# EAGLE design grab (EAGLE 6.6.0)

## Sheet 1 of 2
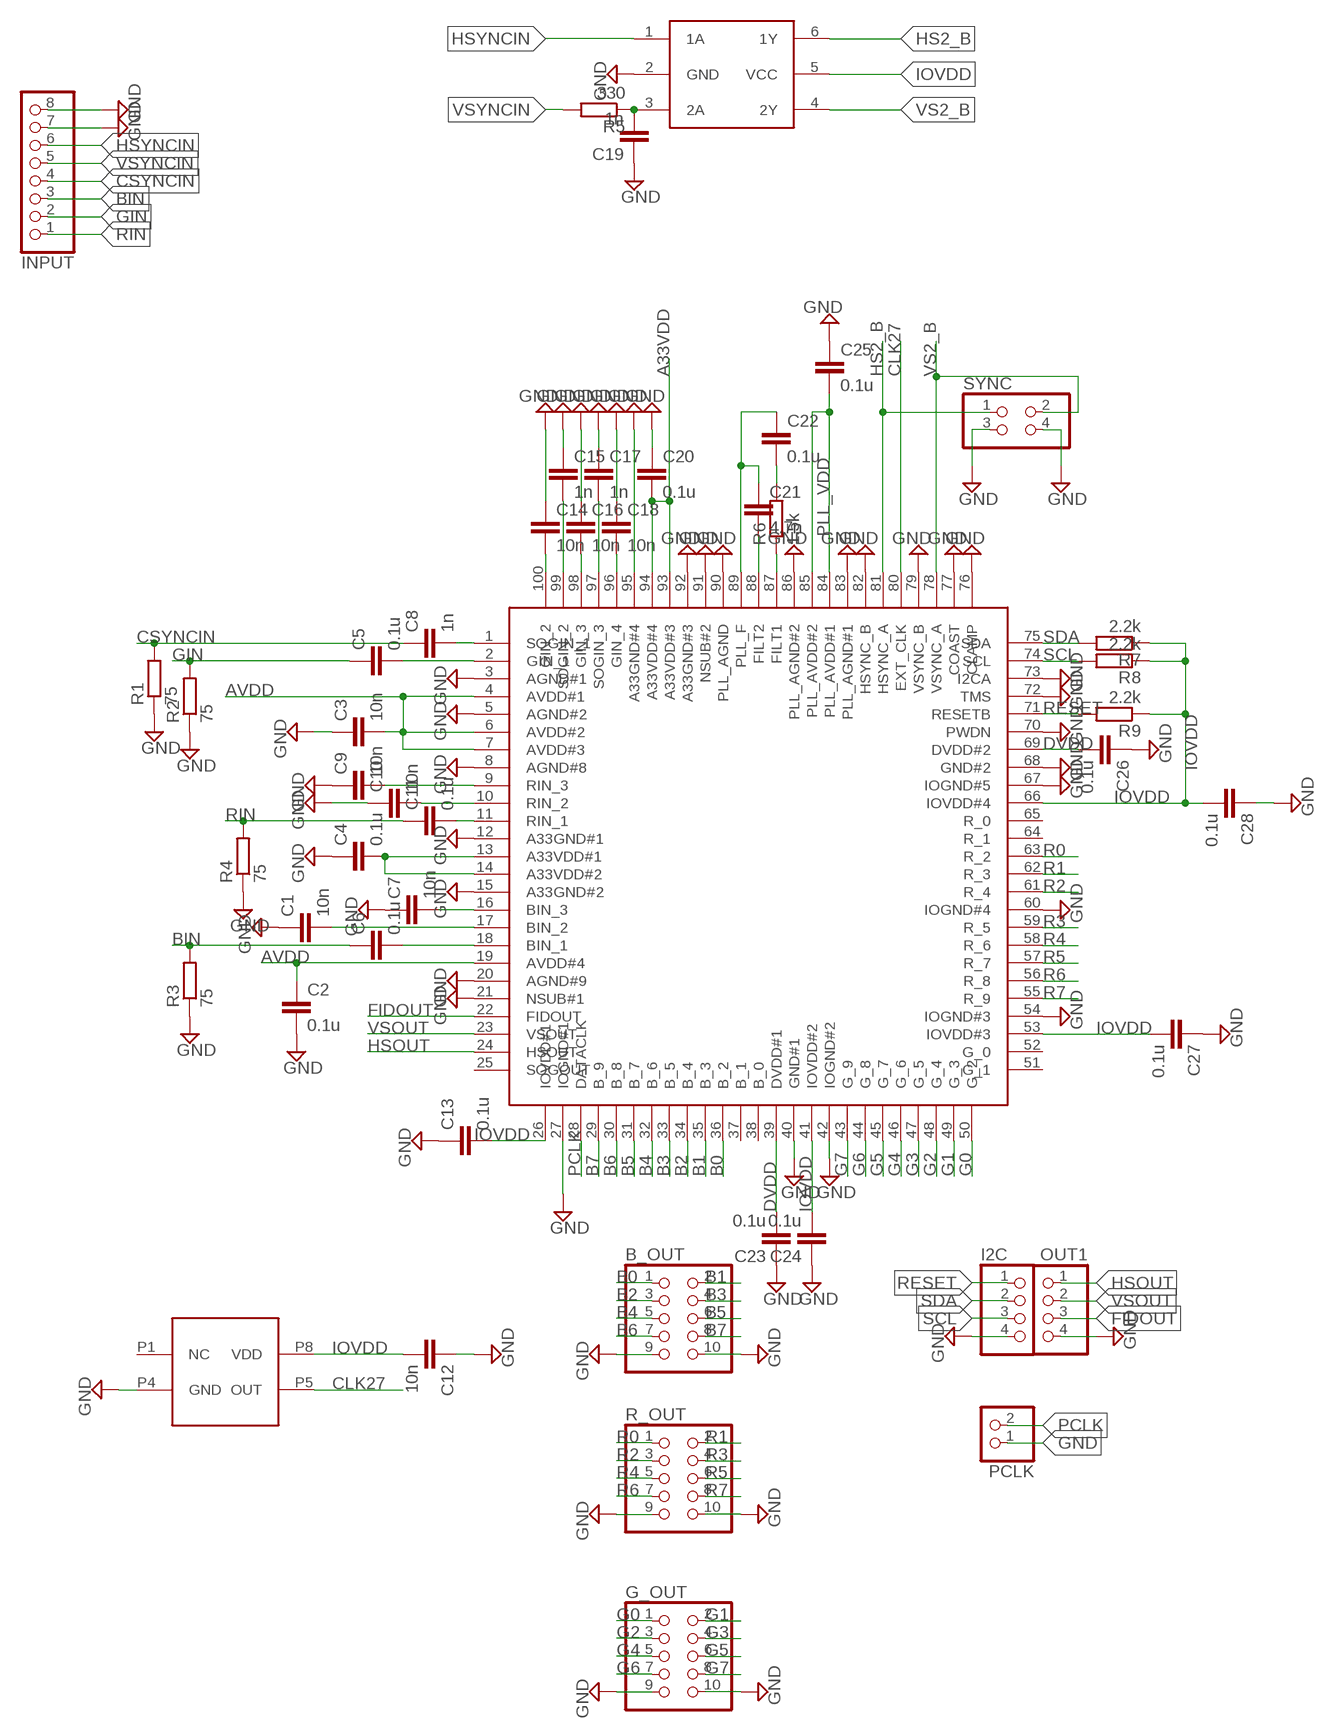
[diagram p0: schematic, sheet 1]

### Parts
27MHZ  ACHL-27MHZ-EK  [DIP4]
B_OUT  PINHD-2X5  [2X05]
C1  10n  C-EUC0603  [C0603]
C2  0.1u  C-EUC0603  [C0603]
C3  10n  C-EUC0603  [C0603]
C4  0.1u  C-EUC0603  [C0603]
C5  0.1u  C-EUC0603  [C0603]
C6  0.1u  C-EUC0603  [C0603]
C7  10n  C-EUC0603  [C0603]
C8  1n  C-EUC0603  [C0603]
C9  10n  C-EUC0603  [C0603]
C10  10n  C-EUC0603  [C0603]
C11  0.1u  C-EUC0603  [C0603]
C12  10n  C-EUC0805  [C0805]
C13  0.1u  C-EUC0603  [C0603]
C14  10n  C-EUC0603  [C0603]
C15  1n  C-EUC0603  [C0603]
C16  10n  C-EUC0603  [C0603]
C17  1n  C-EUC0603  [C0603]
C18  10n  C-EUC0603  [C0603]
C19  1n  C-EUC0805  [C0805]
C20  0.1u  C-EUC0603  [C0603]
C21  4.7n  C-EUC0603  [C0603]
C22  0.1u  C-EUC0603  [C0603]
C23  0.1u  C-EUC0603  [C0603]
C24  0.1u  C-EUC0603  [C0603]
C25  0.1u  C-EUC0603  [C0603]
C26  0.1u  C-EUC0603  [C0603]
C27  0.1u  C-EUC0603  [C0603]
C28  0.1u  C-EUC0603  [C0603]
G_OUT  PINHD-2X5  [2X05]
I2C  PINHD-1X4  [1X04]
INPUT  PINHD-1X8  [1X08]
OUT1  PINHD-1X4  [1X04]
PCLK  PINHD-1X2  [1X02]
R1  75  R-EU_R0603  [R0603]
R2  75  R-EU_R0603  [R0603]
R3  75  R-EU_R0603  [R0603]
R4  75  R-EU_R0603  [R0603]
R5  330  R-EU_R0805  [R0805]
R6  1.5k  R-EU_R0603  [R0603]
R7  2.2k  R-EU_R0603  [R0603]
R8  2.2k  R-EU_R0603  [R0603]
R9  2.2k  R-EU_R0603  [R0603]
R_OUT  PINHD-2X5  [2X05]
SYNC  PINHD-2X2  [2X02]
SYNC_IC  SN74LVC2G17SC-70-6  [SC70-6L]
TVP7002  TVP7002  [TQFP100]

### Nets
A33VDD: C4.2 C20.2 TVP7002.13(A33VDD#1) TVP7002.14(A33VDD#2) TVP7002.93(A33VDD#3) TVP7002.94(A33VDD#4) ; also sheet 2
AVDD: C2.1 C3.2 TVP7002.4(AVDD#1) TVP7002.6(AVDD#2) TVP7002.7(AVDD#3) TVP7002.19(AVDD#4) ; also sheet 2
B0: B_OUT.1 TVP7002.36(B_2)
B1: B_OUT.2 TVP7002.35(B_3)
B2: B_OUT.3 TVP7002.34(B_4)
B3: B_OUT.4 TVP7002.33(B_5)
B4: B_OUT.5 TVP7002.32(B_6)
B5: B_OUT.6 TVP7002.31(B_7)
B6: B_OUT.7 TVP7002.30(B_8)
B7: B_OUT.8 TVP7002.29(B_9)
BIN: C6.1 INPUT.3 R3.2
CLK27: 27MHZ.P5(OUT) TVP7002.80(EXT_CLK)
CSYNCIN: C8.1 INPUT.4 R1.2
DVDD: C23.2 C26.2 TVP7002.39(DVDD#1) TVP7002.69(DVDD#2) ; also sheet 2
FIDOUT: OUT1.3 TVP7002.22(FIDOUT)
G0: G_OUT.1 TVP7002.50(G_2)
G1: G_OUT.2 TVP7002.49(G_3)
G2: G_OUT.3 TVP7002.48(G_4)
G3: G_OUT.4 TVP7002.47(G_5)
G4: G_OUT.5 TVP7002.46(G_6)
G5: G_OUT.6 TVP7002.45(G_7)
G6: G_OUT.7 TVP7002.44(G_8)
G7: G_OUT.8 TVP7002.43(G_9)
GIN: C5.1 INPUT.2 R2.2
GND: 27MHZ.P4(GND) B_OUT.9 B_OUT.10 C1.1 C2.2 C3.1 C4.1 C7.1 C9.1 C10.1 C12.1 C13.1 C14.1 C15.1 C16.1 C17.1 C18.1 C19.1 C20.1 C23.1 C24.1 C25.1 C26.1 C27.1 C28.1 G_OUT.9 G_OUT.10 I2C.4 INPUT.7 INPUT.8 OUT1.4 PCLK.1 R1.1 R2.1 R3.1 R4.1 R_OUT.9 R_OUT.10 SYNC.3 SYNC.4 SYNC_IC.2(GND) TVP7002.3(AGND#1) TVP7002.5(AGND#2) TVP7002.8(AGND#8) TVP7002.12(A33GND#1) TVP7002.15(A33GND#2) TVP7002.20(AGND#9) TVP7002.21(NSUB#1) TVP7002.27(IOGND#1) TVP7002.40(GND#1) TVP7002.42(IOGND#2) TVP7002.54(IOGND#3) TVP7002.60(IOGND#4) TVP7002.67(IOGND#5) TVP7002.68(GND#2) TVP7002.70(PWDN) TVP7002.72(TMS) TVP7002.73(I2CA) TVP7002.76(CLAMP) TVP7002.77(COAST) TVP7002.79(VSYNC_B) TVP7002.82(HSYNC_B) TVP7002.83(PLL_AGND#1) TVP7002.86(PLL_AGND#2) TVP7002.90(PLL_AGND) TVP7002.91(NSUB#2) TVP7002.92(A33GND#3) TVP7002.95(A33GND#4) ; also sheet 2
HS2_B: SYNC.1 SYNC_IC.6(1Y) TVP7002.81(HSYNC_A)
HSOUT: OUT1.1 TVP7002.24(HSOUT)
HSYNCIN: INPUT.6 SYNC_IC.1(1A)
IOVDD: 27MHZ.P8(VDD) C12.2 C13.2 C24.2 C27.2 C28.2 R7.1 R8.1 R9.1 SYNC_IC.5(VCC) TVP7002.26(IOVDD#1) TVP7002.41(IOVDD#2) TVP7002.53(IOVDD#3) TVP7002.66(IOVDD#4) ; also sheet 2
N$1: C8.2 TVP7002.1(SOGIN_1)
N$2: C5.2 TVP7002.2(GIN_1)
N$3: C11.2 TVP7002.11(RIN_1)
N$4: C19.2 R5.1 SYNC_IC.3(2A)
N$5: C7.2 TVP7002.16(BIN_3)
N$6: C14.2 TVP7002.100(GIN_2)
N$7: C15.2 TVP7002.99(SOGIN_2)
N$8: C16.2 TVP7002.98(GIN_3)
N$9: C9.2 TVP7002.9(RIN_3)
N$10: C10.2 TVP7002.10(RIN_2)
N$11: C1.2 TVP7002.17(BIN_2)
N$12: C6.2 TVP7002.18(BIN_1)
N$13: C17.2 TVP7002.97(SOGIN_3)
N$14: C18.2 TVP7002.96(GIN_4)
N$28: C21.2 TVP7002.88(FILT2)
N$29: R6.1 TVP7002.87(FILT1)
N$34: C22.2 R6.2
N$35: C21.1 C22.1 TVP7002.89(PLL_F)
PCLK: PCLK.2 TVP7002.28(DATACLK)
PLL_VDD: C25.2 TVP7002.84(PLL_AVDD#1) TVP7002.85(PLL_AVDD#2) ; also sheet 2
R0: R_OUT.1 TVP7002.63(R_2)
R1: R_OUT.2 TVP7002.62(R_3)
R2: R_OUT.3 TVP7002.61(R_4)
R3: R_OUT.4 TVP7002.59(R_5)
R4: R_OUT.5 TVP7002.58(R_6)
R5: R_OUT.6 TVP7002.57(R_7)
R6: R_OUT.7 TVP7002.56(R_8)
R7: R_OUT.8 TVP7002.55(R_9)
RESET: I2C.1 R9.2 TVP7002.71(RESETB)
RIN: C11.1 INPUT.1 R4.2
SCL: I2C.3 R8.2 TVP7002.74(SCL)
SDA: I2C.2 R7.2 TVP7002.75(SDA)
VS2_B: SYNC.2 SYNC_IC.4(2Y) TVP7002.78(VSYNC_A)
VSOUT: OUT1.2 TVP7002.23(VSOUT)
VSYNCIN: INPUT.5 R5.2
Unconnected: 27MHZ.P1(NC) TVP7002.25(SOGOUT) TVP7002.37(B_1) TVP7002.38(B_0) TVP7002.51(G_1) TVP7002.52(G_0) TVP7002.64(R_1) TVP7002.65(R_0)

## Sheet 2 of 2
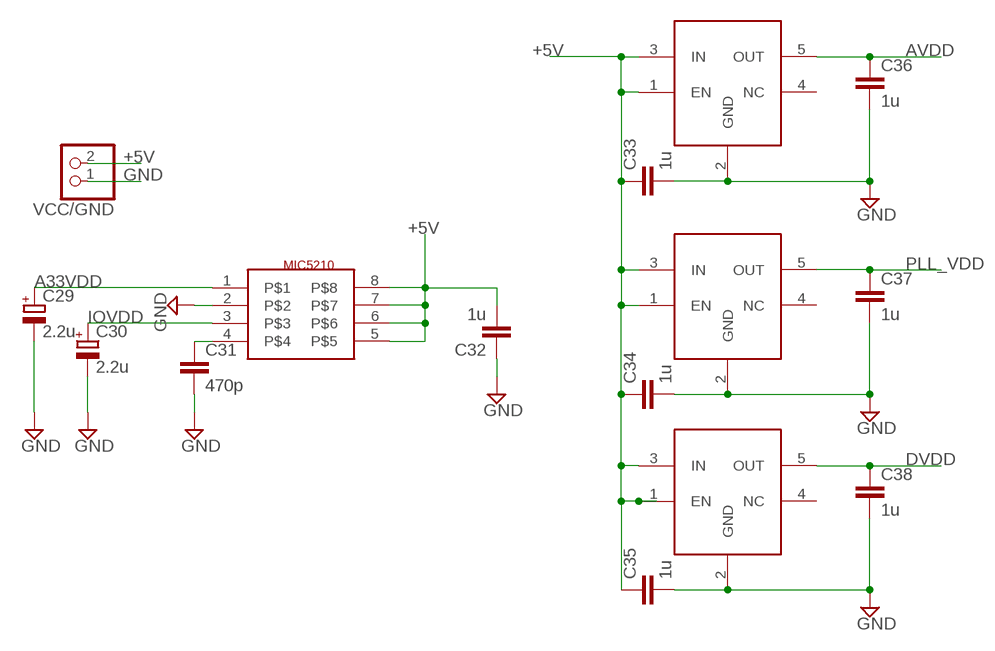
[diagram p1: schematic, sheet 2]

### Parts
C29  2.2u  CPOL-EUB45181A  [B45181A]
C30  2.2u  CPOL-EUB45181A  [B45181A]
C31  470p  C-EUC0805  [C0805]
C32  1u  C-EUC0805  [C0805]
C33  1u  C-EUC0805  [C0805]
C34  1u  C-EUC0805  [C0805]
C35  1u  C-EUC0805  [C0805]
C36  1u  C-EUC0805  [C0805]
C37  1u  C-EUC0805  [C0805]
C38  1u  C-EUC0805  [C0805]
VCC/GND  PINHD-1X2  [1X02]
VREG1  MIC5210MSOP8  [MSOP8]
VREG2  TLV70019SOT23-5L  [SOT23-5L]
VREG3  TLV70019SOT23-5L  [SOT23-5L]
VREG4  TLV70019SOT23-5L  [SOT23-5L]

### Nets
+5V: C32.2 C33.1 C34.1 C35.1 VCC/GND.2 VREG1.5 VREG1.6 VREG1.7 VREG1.8 VREG2.1(EN) VREG2.3(IN) VREG3.1(EN) VREG3.3(IN) VREG4.1(EN) VREG4.3(IN)
A33VDD: C29.+ VREG1.1 ; also sheet 1
AVDD: C36.1 VREG2.5(OUT) ; also sheet 1
DVDD: C38.1 VREG4.5(OUT) ; also sheet 1
GND: C29.- C30.- C31.2 C32.1 C33.2 C34.2 C35.2 C36.2 C37.2 C38.2 VCC/GND.1 VREG1.2 VREG2.2(GND) VREG3.2(GND) VREG4.2(GND) ; also sheet 1
IOVDD: C30.+ VREG1.3 ; also sheet 1
N$15: C31.1 VREG1.4
PLL_VDD: C37.1 VREG3.5(OUT) ; also sheet 1
Unconnected: VREG2.4(NC) VREG3.4(NC) VREG4.4(NC)

## Library data of the parts
27MHZ = buffiscreengrab:ACHL-27MHZ-EK
B_OUT G_OUT R_OUT = pinhead:PINHD-2X5: PIN HEADER
C1-C11 C13-C18 C20-C28 C31-C38 = resistor:C-EU: CAPACITOR, European symbol
C12 C19 = rcl:C-EU: CAPACITOR, European symbol
C29 C30 = resistor:CPOL-EU: POLARIZED CAPACITOR, European symbol
I2C OUT1 = pinhead:PINHD-1X4: PIN HEADER
INPUT = pinhead:PINHD-1X8: PIN HEADER
PCLK VCC/GND = pinhead:PINHD-1X2: PIN HEADER
R1-R4 R6-R9 = resistor:R-EU_: RESISTOR, European symbol
R5 = rcl:R-EU_: RESISTOR, European symbol
SYNC = pinhead:PINHD-2X2: PIN HEADER
SYNC_IC = buffiscreengrab:SN74LVC2G17
TVP7002 = buffiscreengrab:TVP7002
VREG1 = buffiscreengrab:MIC5210
VREG2-VREG4 = buffiscreengrab:TLV70019

## Board
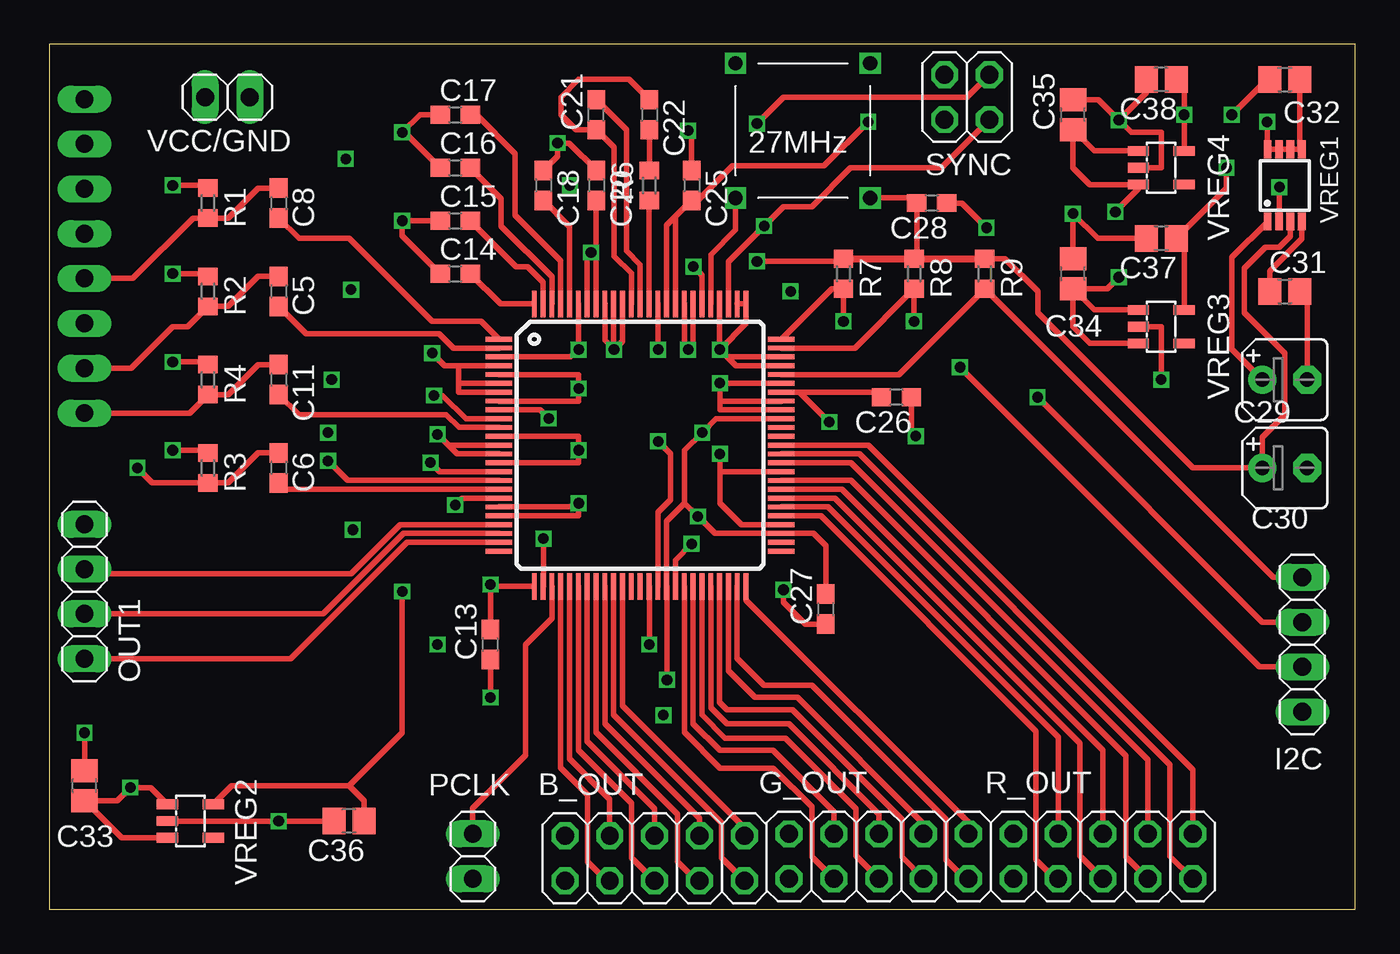
[diagram p2: board, top side]
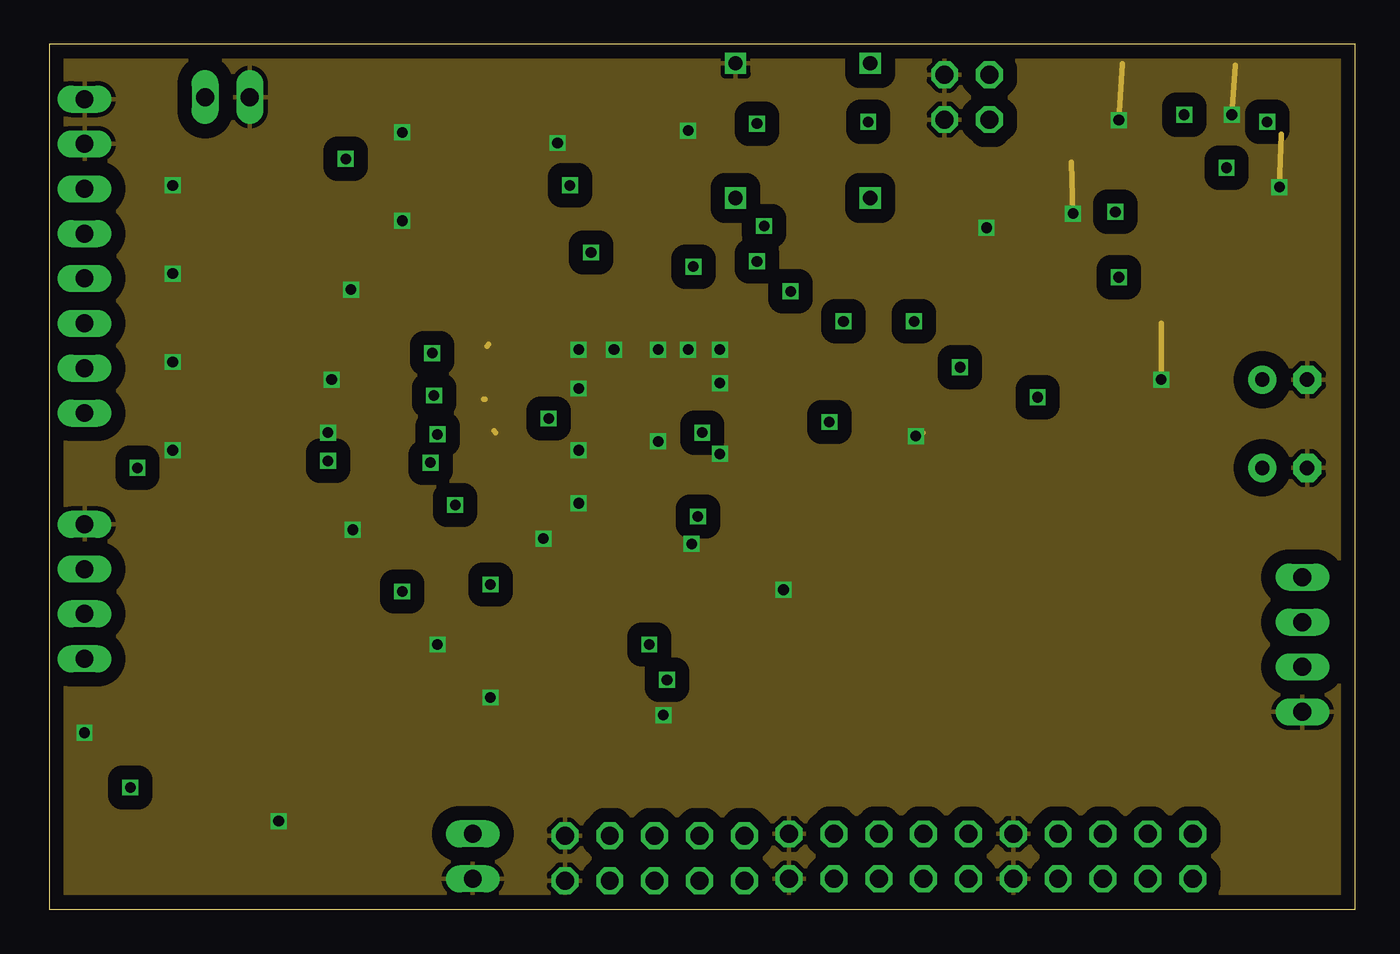
[diagram p3: board, inner layer Route2]
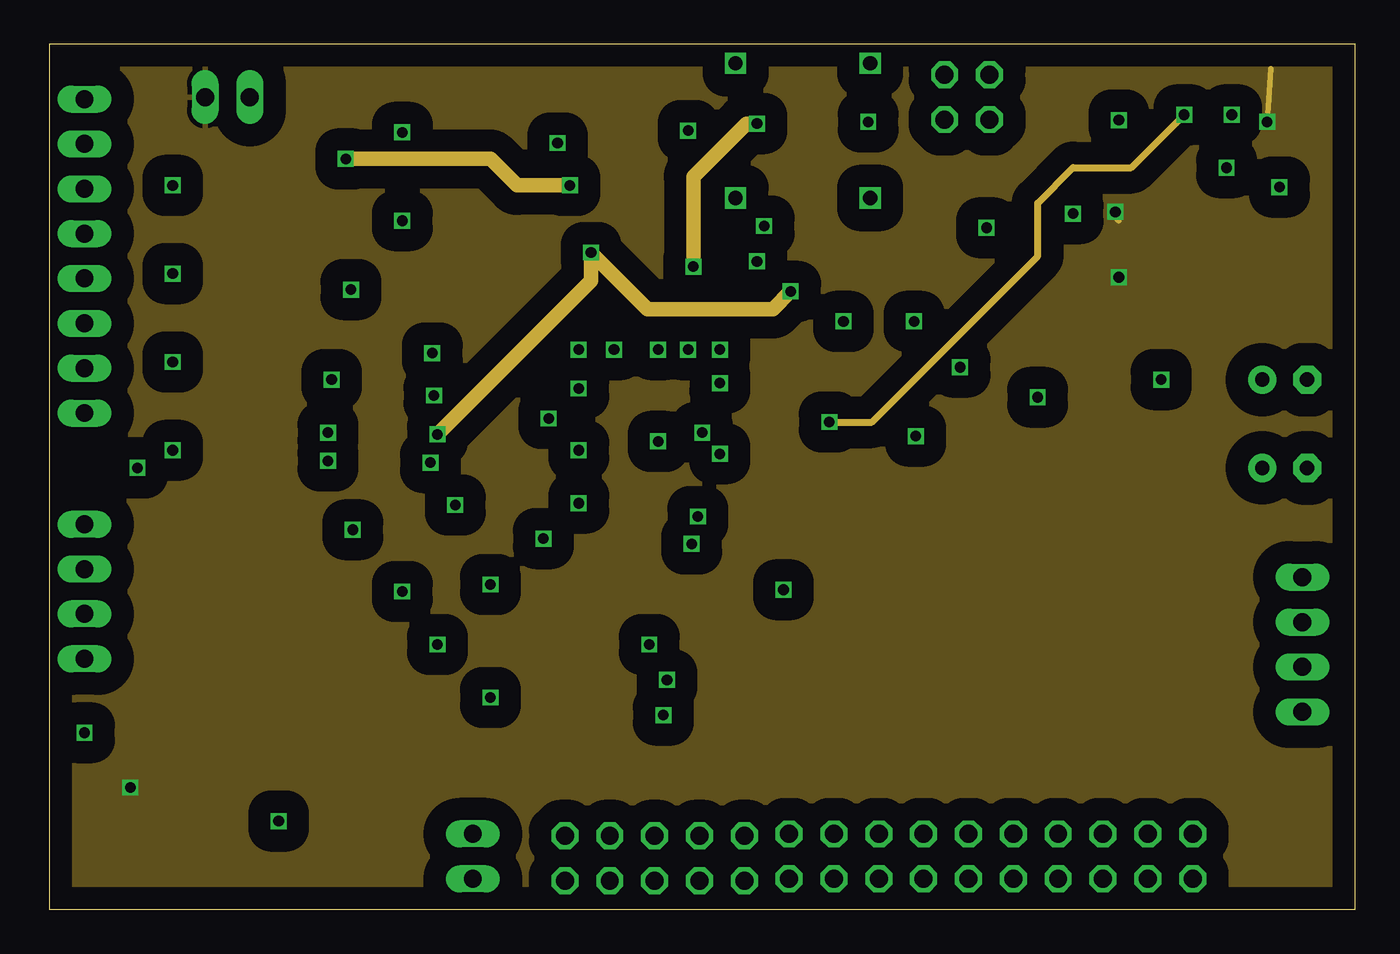
[diagram p4: board, inner layer Route15]
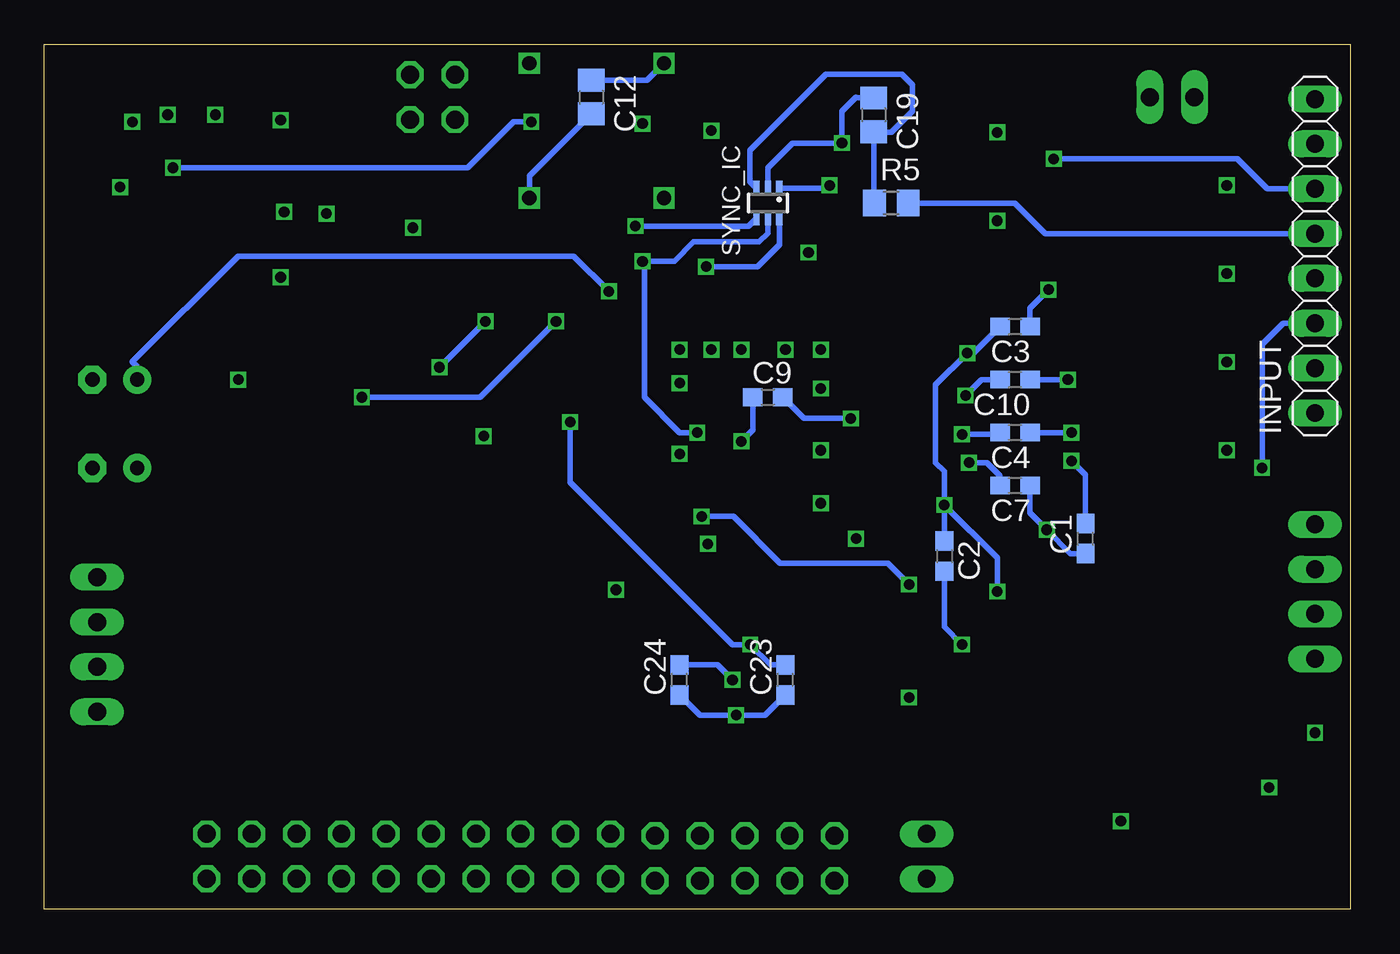
[diagram p5: board, bottom side, seen from below]

Size 74 x 49 mm. Coordinates in mm from the lower left corner, seen from the top.
Outline: 0,0 74,0 74,49 0,49 0,0
Copper layers (1*2*15*16): Top 0.035mm / dielectric 0.2mm / Route2 0.0175mm / dielectric 0.3mm / Route15 0.0175mm / dielectric 0.2mm / Bottom 0.035mm
Design rules "SeeedStudio_4layer_DRU_no_angle_20140221 *": minimum track width 8mil, minimum drill 12mil, track to track 6mil, track to pad 6mil, pad to pad 6mil, via to via 8mil, smd to smd 0mil, copper to edge 10mil, drill to drill 8mil, minimum pad ring 6mil, minimum via ring 4mil, stop-mask expansion 4mil, vias tented up to drill 100mil, thermal gap 10mil

### Footprints (pad centres in the part's own frame; a part is rotated, then mirrored left to right if it is on the bottom)
DIP4 = drill 0.8 square: P1 -3.81,-3.81; P4 3.81,-3.81; P5 3.81,3.81; P8 -3.81,3.81
2X05 = drill 1.016 octagon: 1 -5.08,-1.27; 2 -5.08,1.27; 3 -2.54,-1.27; 4 -2.54,1.27; 5 0,-1.27; 6 0,1.27; 7 2.54,-1.27; 8 2.54,1.27; 9 5.08,-1.27; 10 5.08,1.27
C0603 = smd 1.1 x 1: 1 -0.85,0; 2 0.85,0
C0805 = smd 1.3 x 1.5: 1 -0.95,0; 2 0.95,0
B45181A = drill 0.813 pad 1.6: + -1.27,0 | drill 0.813 pad 1.6 octagon: - 1.27,0
C0805' = smd 1.3 x 1.5: 1 -0.85,0; 2 0.85,0
1X04 = drill 1.016 long: 1 -3.81,0; 2 -1.27,0; 3 1.27,0; 4 3.81,0
1X08 = drill 1.016 long: 1 -8.89,0; 2 -6.35,0; 3 -3.81,0; 4 -1.27,0; 5 1.27,0; 6 3.81,0; 7 6.35,0; 8 8.89,0
1X02 = drill 1.016 long: 1 -1.27,0; 2 1.27,0
R0603 = smd 1 x 1.1: 1 -0.85,0; 2 0.85,0
R0805 = smd 1.3 x 1.5: 1 -0.95,0; 2 0.95,0
2X02 = drill 1.016 octagon: 1 -1.27,-1.27; 2 -1.27,1.27; 3 1.27,-1.27; 4 1.27,1.27
SC70-6L = smd 0.35 x 0.8: 1 -0.65,-0.85; 2 0,-0.85; 3 0.65,-0.85; 4 0.65,0.85; 5 0,0.85; 6 -0.65,0.85
TQFP100 = smd 1.5 x 0.274: 1 -8,6; 2 -8,5.5; 3 -8,5; 4 -8,4.5; 5 -8,4; 6 -8,3.5; 7 -8,3; 8 -8,2.5; 9 -8,2; 10 -8,1.5; 11 -8,1; 12 -8,0.5; 13 -8,0; 14 -8,-0.5; 15 -8,-1; 16 -8,-1.5; 17 -8,-2; 18 -8,-2.5; 19 -8,-3; 20 -8,-3.5; 21 -8,-4; 22 -8,-4.5; 23 -8,-5; 24 -8,-5.5; 25 -8,-6; 51 8,-6; 52 8,-5.5; 53 8,-5; 54 8,-4.5; 55 8,-4; 56 8,-3.5; 57 8,-3; 58 8,-2.5; 59 8,-2; 60 8,-1.5; 61 8,-1; 62 8,-0.5; 63 8,0; 64 8,0.5; 65 8,1; 66 8,1.5; 67 8,2; 68 8,2.5; 69 8,3; 70 8,3.5; 71 8,4; 72 8,4.5; 73 8,5; 74 8,5.5; 75 8,6 | smd 0.274 x 1.5: 26 -6,-8; 27 -5.5,-8; 28 -5,-8; 29 -4.5,-8; 30 -4,-8; 31 -3.5,-8; 32 -3,-8; 33 -2.5,-8; 34 -2,-8; 35 -1.5,-8; 36 -1,-8; 37 -0.5,-8; 38 0,-8; 39 0.5,-8; 40 1,-8; 41 1.5,-8; 42 2,-8; 43 2.5,-8; 44 3,-8; 45 3.5,-8; 46 4,-8; 47 4.5,-8; 48 5,-8; 49 5.5,-8; 50 6,-8; 76 6,8; 77 5.5,8; 78 5,8; 79 4.5,8; 80 4,8; 81 3.5,8; 82 3,8; 83 2.5,8; 84 2,8; 85 1.5,8; 86 1,8; 87 0.5,8; 88 0,8; 89 -0.5,8; 90 -1,8; 91 -1.5,8; 92 -2,8; 93 -2.5,8; 94 -3,8; 95 -3.5,8; 96 -4,8; 97 -4.5,8; 98 -5,8; 99 -5.5,8; 100 -6,8
MSOP8 = smd 0.45 x 1: 1 -0.975,-2.05; 2 -0.325,-2.05; 3 0.325,-2.05; 4 0.975,-2.05; 5 0.975,2.05; 6 0.325,2.05; 7 -0.325,2.05; 8 -0.975,2.05
SOT23-5L = smd 0.55 x 1.2: 1 -0.95,-1.3; 2 0,-1.3; 3 0.95,-1.3; 4 0.95,1.3; 5 -0.95,1.3

### Placement (x,y rotation side)
27MHZ  42.7,44.1 180 top
B_OUT  34.3,2.9 180 top
C1  15,21 90 bottom
C2  23,20 270 bottom
C3  19,33 180 bottom
C4  19,27 180 bottom
C5  13,35 270 top
C6  13,25 270 top
C7  19,24 180 bottom
C8  13,40 270 top
C9  33,29 0 bottom
C10  19,30 180 bottom
C11  13,30 270 top
C12  43,46 270 bottom
C13  25,15 90 top
C14  23,36 0 top
C15  23,39 0 top
C16  23,42 0 top
C17  23,45 0 top
C18  28,41 270 top
C19  27,45 270 bottom
C20  31,41 270 top
C21  31,45 90 top
C22  34,45 270 top
C23  32,13 90 bottom
C24  38,13 90 bottom
C25  36.4,41 270 top
C26  48,29 180 top
C27  44,17 90 top
C28  50,40 180 top
C29  70,30 0 top
C30  70,25 0 top
C31  470p  [C0805']  70,35 0 top
C32  1u  [C0805']  70,47 0 top
C33  1u  [C0805']  2,7 90 top
C34  1u  [C0805']  58,36 90 top
C35  1u  [C0805']  58,45 90 top
C36  1u  [C0805']  17,5 180 top
C37  1u  [C0805']  63,38 180 top
C38  1u  [C0805']  63,47 180 top
G_OUT  47,3 180 top
I2C  71,15 270 top
INPUT  2,37 90 bottom
OUT1  2,18 90 top
PCLK  24,3 90 top
R1  9,40 270 top
R2  9,35 270 top
R3  9,25 270 top
R4  9,30 270 top
R5  26,40 0 bottom
R6  34,41 90 top
R7  45,36 270 top
R8  49,36 270 top
R9  53,36 270 top
R_OUT  59.7,3 180 top
SYNC  52,46 180 top
SYNC_IC  33,40 180 bottom
TVP7002  33.48,26.29 0 top
VCC/GND  10.1,46 180 top
VREG1  70,41 0 top
VREG2  8,5 270 top
VREG3  63,33 270 top
VREG4  63,42 270 top

### Tracks (layer width: path | path; a pad name or v marks a point on that pad's centre or on a via)
+5V  (via drill 0.6)
  Top 0.305: VREG2.3 4.1,4.05 C33.1 3.85,6.15 v4.6,6.9 5.75,6.9 VREG2.1 | VREG4.1 59.2,42.95 C35.1 58,42 58.95,41.05 VREG4.3 61.7,40.8 v60.4,39.5 | VREG3.1 59.2,33.95 C34.1 | VREG3.3 58.95,32.05 58,33 C34.1 | C32.2 70.85,43.17 VREG1.5 VREG1.6 VREG1.7 VREG1.8 69,43.08 v69,44.6 | C34.1 59.95,35.15 v60.6,35.8
  Route15 0.305: v69,44.6 69.2,47.6 | v4.6,6.9 4.7,6.9 | 60.6,39 60.5,39.1
  pour Route15 (isolate 1.27): 0,50 74,50 74,0 0,0
A33VDD  (via drill 0.6)
  Top 0.305: TVP7002.93 30.98,37.22 | 30.98,37.22 30.98,40.13 C20.2 | C29.+ 67,31.73 67,36.92 VREG1.1 | 30.98,37.22 30.72,37.22 v30.7,37.2 30.48,36.98 TVP7002.94 | TVP7002.13 22.61,26.29 v22,26.9 23.11,25.79 TVP7002.14
  Route15 0.813: v42,35 41,34 33.9,34 v30.7,37.2 30.7,35.6 v22,26.9
  Bottom 0.305: v42,35 44,37 63,37 69,31 68.73,30.73 C29.+ | v22,26.9 19.95,26.9 C4.2
AVDD  (via drill 0.6)
  Top 0.305: VREG2.5 10.35,7 17,7 | 17,7 17.85,6.15 C36.1 | TVP7002.6 23.2,29.79 | 23.2,29.79 23.2,30.79 | 23.2,30.79 TVP7002.4 | TVP7002.7 23.2,29.29 23.2,29.79 | 23.2,30.79 22.41,30.79 v21.7,31.5 | TVP7002.19 23.39,23.29 v23,22.9 | 17,7 20,10 v20,18
  Bottom 0.305: C3.2 21.35,31.5 v21.7,31.5 23.5,29.7 23.5,25.3 23,24.8 v23,22.9 | v23,22.9 C2.1 | v20,18 20,19.9 v23,22.9
B0
  Top 0.305: TVP7002.36 32.48,11.52 39.38,4.62 B_OUT.1
B1
  Top 0.305: TVP7002.35 31.98,11.02 38.1,4.9 38.1,2.91 B_OUT.2
B2
  Top 0.305: TVP7002.34 31.48,10.52 36.84,5.16 B_OUT.3
B3
  Top 0.305: TVP7002.33 30.98,10.02 35.6,5.4 35.6,2.7 36.67,1.63 B_OUT.4
B4
  Top 0.305: TVP7002.32 30.48,9.52 34.3,5.7 B_OUT.5
B5
  Top 0.305: TVP7002.31 29.98,9.02 33,6 33,2.93 B_OUT.6
B6
  Top 0.305: TVP7002.30 29.48,8.52 31.76,6.24 B_OUT.7
B7
  Top 0.305: TVP7002.29 28.98,8.02 30.5,6.5 30.5,2.7 31.57,1.63 B_OUT.8
BIN  (via drill 0.6)
  Top 0.305: C6.1 11.85,25.85 10.15,24.15 R3.2 5.85,24.15 v5,25
  Bottom 0.305: v5,25 5,32 3.81,33.19 INPUT.3
CLK27
  Top 0.305: 27MHZ.P5 38.89,38.49 37.48,37.08 TVP7002.80
CSYNCIN
  Top 0.305: C8.1 11.85,40.85 10.15,39.15 R1.2 8.15,39.15 4.73,35.73 INPUT.4
DVDD  (via drill 0.6)
  Top 0.305: TVP7002.39 34,18.27 v34,15 | C26.2 46.86,29.29 TVP7002.69 42.51,29.29 v44.2,27.6 | VREG4.5 64.3,44.9 | v64.3,45 64.3,46.55 C38.1
  Top 0.406: v64.3,45 64.3,44.9
  Route15 0.406: v44.2,27.6 46.6,27.6 56,37 56,40 58,42 61.3,42 v64.3,45
  Bottom 0.305: C23.2 32.85,13.85 v34,15 35,15 44.2,24.2 v44.2,27.6
FIDOUT
  Top 0.305: TVP7002.22 19.89,21.79 17.1,19 2.27,19 OUT1.3
G0
  Top 0.305: TVP7002.50 39.48,17.52 52.08,4.92 G_OUT.1
G1
  Top 0.305: TVP7002.49 38.98,14.22 40.5,12.7 43.2,12.7 50.8,5.1 50.8,2.8 51.87,1.73 G_OUT.2
G2
  Top 0.305: TVP7002.48 38.48,13.52 40,12 42.4,12 49.54,4.86 G_OUT.3
G3
  Top 0.305: TVP7002.47 37.98,11.72 38.4,11.3 42.1,11.3 48.3,5.1 48.3,2.97 G_OUT.4
G4
  Top 0.305: TVP7002.46 37.48,11.42 38.4,10.5 41.9,10.5 47,5.4 G_OUT.5
G5
  Top 0.305: TVP7002.45 36.98,11.02 38.3,9.7 41.7,9.7 45.7,5.7 45.7,3.03 G_OUT.6
G6
  Top 0.305: TVP7002.44 36.48,10.52 38,9 41,9 44.46,5.54 G_OUT.7
G7
  Top 0.305: TVP7002.43 35.98,10.02 38,8 41,8 43.2,5.8 43.2,2.99 G_OUT.8
GIN
  Top 0.305: C5.1 11.85,35.85 10.15,34.15 R2.2 7.85,33 7,33 4.65,30.65 INPUT.2
GND  (via drill 0.6)
  Top 0.305: C33.2 v2,10 | C36.2 v13,5 VREG2.2 | TVP7002.79 37.98,31.72 v38,31.7 | TVP7002.83 35.98,31.92 v36.2,31.7 36.48,31.98 TVP7002.82 | TVP7002.86 34.48,31.72 v34.5,31.7 | TVP7002.95 29.98,31.72 | 29.98,31.72 v30,31.7 | 29.98,31.72 29.55,31.29 TVP7002.3 | TVP7002.60 38.01,24.79 v38,25.8 38,23 39.21,21.79 TVP7002.54 | TVP7002.73 38.41,31.29 | 38.41,31.29 v38,31.7 | TVP7002.77 TVP7002.76 39.48,33.18 v38,31.7 | TVP7002.72 38.91,30.79 38.41,31.29 | TVP7002.70 v38.01,29.79 v38,29.8 | TVP7002.68 38,28.79 v38,29.8 | TVP7002.67 38,28.29 v38,29.8 | TVP7002.42 35.48,19.78 v36.4,20.7 | TVP7002.5 30,30.29 v30,29.5 30,28.79 TVP7002.8 | TVP7002.12 30,26.79 v30,26 30,25.29 TVP7002.15 | TVP7002.21 30,22.29 v30,23 30,22.79 TVP7002.20 | TVP7002.27 28,18.29 v28,21 | TVP7002.92 31.48,32.22 v32,31.7 | TVP7002.90 32.48,32.18 v32,31.7 | TVP7002.91 31.98,31.72 v32,31.7 | TVP7002.40 34.48,22.48 35.2,23.2 35.2,25.8 v34.5,26.5 | C18.1 28.8,42.65 v28.8,43.4 29.45,43.4 C20.1 | C15.1 v20,39 20,38.15 C14.1 | C13.1 v25,12 | C27.1 42.85,16.15 41.6,17.4 v41.6,18.1 | R1.1 8.85,41 v7,41 | R2.1 8.85,36 v7,36 | R4.1 8.85,31 v7,31 | R3.1 8.85,26 v7,26 | C28.1 51.7,40 v53.1,38.6 | C37.2 59.4,38 v58,39.4 C34.2 | C38.2 62.15,46.25 v60.6,44.7 | C35.2 59.45,45.85 v60.6,44.7 | C32.1 69,47 v67,45 | VREG1.2 69.7,38.98 v69.7,40.9 | C31.2 71.27,34.58 C29.- | C26.1 48.85,27.05 v49.1,26.8 | VREG3.2 63,33 v63,30 | C25.1 36.4,43.9 v36.2,44.1 | VREG4.2 63,42 63,44 61.3,44 v60.6,44.7 | C16.1 20.15,44 v20,44 21,45 C17.1
  Route2 0.305: 25.2,27.1 25.3,27 | 24.7,28.9 24.6,28.9 | 24.9,32 24.8,31.9 | v53.1,38.6 53.2,38.6 53.3,38.7 | v22,15 22,15.2 | v58,39.4 57.9,42.3 | v60.6,44.7 60.8,47.9 | v67,45 67.2,47.8 | v69.7,40.9 69.8,43.9 | v49.1,26.8 49.2,26.7 49.5,27 | v63,30 63,33.2 | v36.2,44.1 36.2,44.2 | v20,44 20.1,43.9
  Bottom 0.305: C23.1 33.15,11 v34.8,11 36.85,11 C24.1 | C19.1 27.95,45.95 28,46 28.8,45.2 v28.8,43.4 31.6,43.4 33,42 SYNC_IC.2 | C9.1 33.85,27.15 v34.5,26.5 | C4.1 v15.8,27 | C7.1 18.15,22.45 v17.2,21.5 15.85,20.15 C1.1 | C10.1 v16,30 | C3.1 18.15,34.05 v17.1,35.1 | C2.2 23,16 v22,15 | 27MHZ.P4 39.85,46.95 C12.1
  pour Route2 (isolate 0.813): 0,49 74,49 74,0 0,0
HS2_B  (via drill 0.6)
  Top 0.305: TVP7002.81 36.98,35.92 v36.5,36.4 | SYNC.1 52,46 41.6,46 v40.1,44.5
  Route15 0.813: v40.1,44.5 39.5,44.5 36.5,41.5 v36.5,36.4
  Bottom 0.305: v36.5,36.4 33.6,36.4 32.35,37.65 SYNC_IC.6
HSOUT
  Top 0.305: TVP7002.24 20.29,20.79 13.69,14.19 OUT1.1
HSYNCIN  (via drill 0.6)
  Route15 0.813: v16.8,42.5 25,42.5 26.5,41 v29.5,41
  Bottom 0.305: INPUT.6 4.71,40.81 6.4,42.5 v16.8,42.5 | v29.5,41 29.65,40.85 SYNC_IC.1
IOVDD  (via drill 0.6)
  Top 0.305: TVP7002.26 25,18.29 | 36,23 v36.75,22.25 37.71,21.29 TVP7002.53 43.31,21.29 44,20.6 C27.2 | 36,23 36,26 v37,27 37.79,27.79 TVP7002.66 | 36,23 34.98,21.98 TVP7002.41 35,18.27 v35,13 | 25,18.29 v25,18.4 | 25,18.29 C13.2 | R8.1 49.15,37 C28.2 48.86,40.29 27MHZ.P8 | v40.1,36.7 44.85,36.7 R7.1 | VREG1.3 70.33,38.12 69.7,37.5 68.9,37.5 67.7,36.3 67.7,33.8 70,31.5 70,28 68.73,26.73 C30.+ 64.8,25 56,33.8 56,35 54.15,36.85 R9.1
  Top 0.406: R7.1 R8.1 R9.1
  Bottom 0.305: C24.2 35.85,13.85 v35,13 | v25,18.4 26.2,19.6 32.3,19.6 34.95,22.25 v36.75,22.25 | SYNC_IC.5 33,38.3 33.5,37.8 37.2,37.8 38.3,36.7 v40.1,36.7 40,36.6 40,29 38,27 v37,27 | C12.2 46.51,41.54 27MHZ.P8
N$1
  Top 0.305: TVP7002.1 24.47,33.3 21.7,33.3 17,38 14.15,38 C8.2
N$2
  Top 0.305: TVP7002.2 22.91,31.79 22.1,32.6 14.55,32.6 C5.2
N$3
  Top 0.305: TVP7002.11 23.21,27.29 22.5,28 14.15,28 C11.2
N$4
  Bottom 0.305: R5.1 27,40.05 C19.2 26.95,44 26,44 24.8,45.2 24.8,46.7 25.4,47.3 29.7,47.3 34,43 34,41.2 SYNC_IC.3
N$5  (via drill 0.6)
  Top 0.305: TVP7002.16 22.11,24.79 v21.6,25.3
  Bottom 0.305: v21.6,25.3 20.6,25.3 19.85,24.55 C7.2
N$6
  Top 0.305: TVP7002.100 25.56,34.29 C14.2
N$7
  Top 0.305: TVP7002.99 27.98,35.52 27.1,36.4 26.45,36.4 C15.2
N$8
  Top 0.305: TVP7002.98 28.48,35.82 25.6,38.7 25.6,40.25 C16.2
N$9  (via drill 0.6)
  Top 0.305: TVP7002.9 27.81,28.29 v28.3,27.8
  Bottom 0.305: v28.3,27.8 30.95,27.8 C9.2
N$10  (via drill 0.6)
  Top 0.305: TVP7002.10 23.61,27.79 22.3,29.1 v21.8,29.1
  Bottom 0.305: v21.8,29.1 20.9,30 C10.2
N$11  (via drill 0.6)
  Top 0.305: TVP7002.17 16.91,24.29 v15.8,25.4
  Bottom 0.305: v15.8,25.4 15,24.6 C1.2
N$12
  Top 0.305: TVP7002.18 13.36,23.79 C6.2
N$13
  Top 0.305: TVP7002.97 28.98,36.72 26.4,39.3 26.4,42.8 24.2,45 C17.2
N$14
  Top 0.305: TVP7002.96 29.48,38.67 C18.2
N$15
  Top 0.305: VREG1.4 70.97,37.98 69.15,36.15 C31.1
N$28
  Top 0.305: TVP7002.88 33.48,36.52 32.7,37.3 32.7,44.15 C21.2
N$29
  Top 0.305: TVP7002.87 33.98,40.13 R6.1
N$34
  Top 0.305: R6.2 C22.2
N$35
  Top 0.305: TVP7002.89 32.98,36.02 32,37 32,43.15 C21.1 29.85,44.15 29,45 29,46 30,47 32.85,47 C22.1
PCLK
  Top 0.305: TVP7002.28 28.48,16.48 27,15 27,8.73 24,5.73 PCLK.2
PLL_VDD  (via drill 0.6)
  Top 0.305: TVP7002.84 35.48,39.23 C25.2 | TVP7002.85 34.98,38.73 C25.2 | C25.2 36.75,40.15 38.7,42.1 43.9,42.1 v46.4,44.6 | v66.7,42 66.7,40.85 C37.1 64.3,37.55 VREG3.5
  Bottom 0.305: v46.4,44.6 47.4,44.6 50,42 v66.7,42
R0
  Top 0.305: TVP7002.63 46.41,26.29 64.78,7.92 R_OUT.1
R1
  Top 0.305: TVP7002.62 45.91,25.79 63.5,8.2 63.5,3.01 R_OUT.2
R2
  Top 0.305: TVP7002.61 45.41,25.29 62.24,8.46 R_OUT.3
R3
  Top 0.305: TVP7002.59 45.41,24.29 61,8.7 61,2.97 R_OUT.4
R4
  Top 0.305: TVP7002.58 44.91,23.79 59.7,9 R_OUT.5
R5
  Top 0.305: TVP7002.57 44.51,23.29 58.4,9.4 58.4,3.03 R_OUT.6
R6
  Top 0.305: TVP7002.56 44.11,22.79 57.16,9.74 R_OUT.7
R7
  Top 0.305: TVP7002.55 43.71,22.29 55.9,10.1 55.9,2.8 56.97,1.73 R_OUT.8
RESET
  Top 0.305: TVP7002.71 48.14,30.29 R9.2 69.34,18.81 I2C.1
RIN
  Top 0.305: C11.1 11.85,30.85 10.15,29.15 R4.2 7.96,28.11 INPUT.1
SCL  (via drill 0.6)
  Top 0.305: TVP7002.74 45.64,31.79 R8.2 v49,33.3 | v51.6,30.7 68.57,13.73 I2C.3
  Bottom 0.305: v49,33.3 v51.6,30.7
SDA  (via drill 0.6)
  Top 0.305: TVP7002.75 44.34,35.15 R7.2 v45,33.3 | v56,29 68.73,16.27 I2C.2
  Bottom 0.305: v45,33.3 49.3,29 v56,29
VS2_B  (via drill 0.6)
  Top 0.305: TVP7002.78 38.48,36.68 v40.5,38.7 41.6,39.8 43.2,39.8 45.4,42 50.54,42 SYNC.2
  Bottom 0.305: v40.5,38.7 34.1,38.7 SYNC_IC.4
VSOUT
  Top 0.305: TVP7002.23 20.09,21.29 15.53,16.73 OUT1.2
VSYNCIN
  Bottom 0.305: INPUT.5 17.27,38.27 19,40 R5.2